# Altium schematic sheet Completo.SchDoc: RADAR
size A4; Author: Almela; Revision: 1.2; SheetNumber: 1; SheetTotal: 7
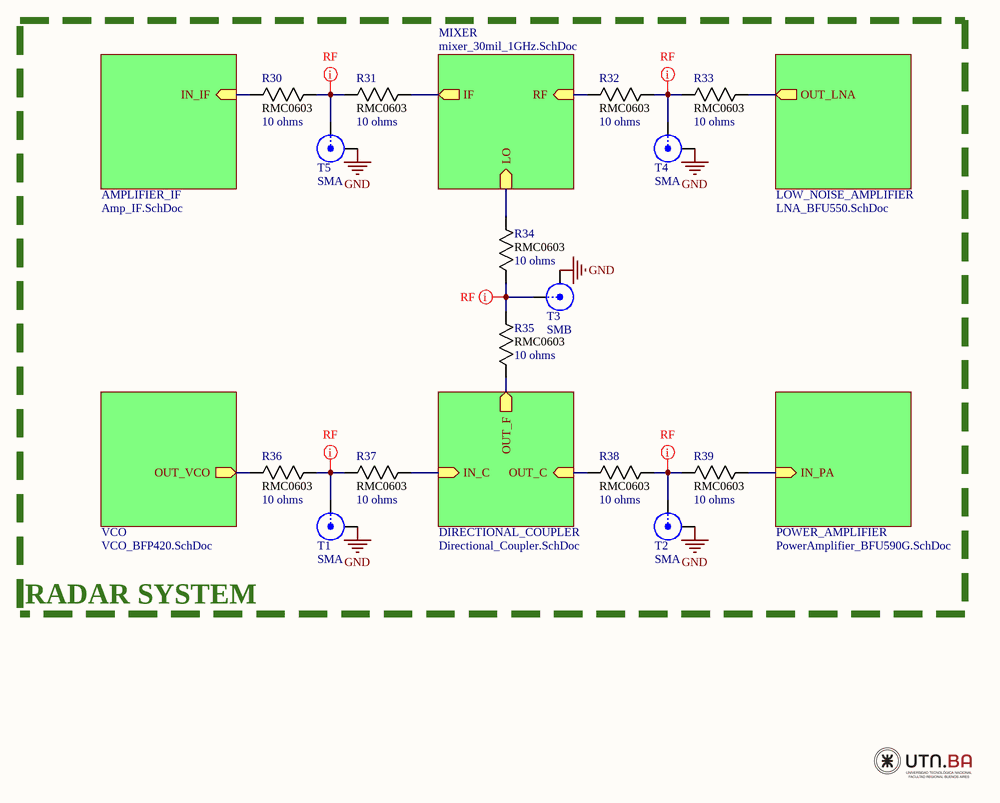
[diagram p0: Completo.SchDoc]

## Parts
R30  value 10 ohms  footprint: RMC0603  [RESC1508X55N]  (hidden comment: Resistor)
R31  value 10 ohms  footprint: RMC0603  [RESC1508X55N]  (hidden comment: Resistor)
R32  value 10 ohms  footprint: RMC0603  [RESC1508X55N]  (hidden comment: Resistor)
R33  value 10 ohms  footprint: RMC0603  [RESC1508X55N]  (hidden comment: Resistor)
R34  value 10 ohms  footprint: RMC0603  [RESC1508X55N]  (hidden comment: Resistor)
R35  value 10 ohms  footprint: RMC0603  [RESC1508X55N]  (hidden comment: Resistor)
R36  value 10 ohms  footprint: RMC0603  [RESC1508X55N]  (hidden comment: Resistor)
R37  value 10 ohms  footprint: RMC0603  [RESC1508X55N]  (hidden comment: Resistor)
R38  value 10 ohms  footprint: RMC0603  [RESC1508X55N]  (hidden comment: Resistor)
R39  value 10 ohms  footprint: RMC0603  [RESC1508X55N]  (hidden comment: Resistor)
T1  SMA  [SMA-142-0701-851]
T2  SMA  [SMA-142-0701-851]
T3  SMB  [SMB_V-RJ45]
T4  SMA  [SMA-142-0701-851]
T5  SMA  [SMA-142-0701-851]

## Sub-sheets
AMPLIFIER_IF = Amp_IF.SchDoc: IN_IF (in)
DIRECTIONAL_COUPLER = Directional_Coupler.SchDoc: IN_C (in), OUT_F (out), OUT_C (in)
LOW_NOISE_AMPLIFIER = LNA_BFU550.SchDoc: OUT_LNA (out)
MIXER = mixer_30mil_1GHz.SchDoc: IF (out), RF (in), LO (in)
POWER_AMPLIFIER = PowerAmplifier_BFU590G.SchDoc: IN_PA (in)
VCO = VCO_BFP420.SchDoc: OUT_VCO (out)

## Nets
GND: T1.2(Y) T2.2(Y) T3.2(Y) T4.2(Y) T5.2(Y)
NetR30_1: R30.1 ; sheet AMPLIFIER_IF/IN_IF
NetR30_2: R30.2 R31.1 T5.1(X)
NetR31_2: R31.2 ; sheet MIXER/IF
NetR32_1: R32.1 ; sheet MIXER/RF
NetR32_2: R32.2 R33.1 T4.1(X)
NetR33_2: R33.2 ; sheet LOW_NOISE_AMPLIFIER/OUT_LNA
NetR34_1: R34.1 R35.2 T3.1(X)
NetR34_2: R34.2 ; sheet MIXER/LO
NetR35_1: R35.1 ; sheet DIRECTIONAL_COUPLER/OUT_F
NetR36_1: R36.1 ; sheet VCO/OUT_VCO
NetR36_2: R36.2 R37.1 T1.1(X)
NetR37_2: R37.2 ; sheet DIRECTIONAL_COUPLER/IN_C
NetR38_1: R38.1 ; sheet DIRECTIONAL_COUPLER/OUT_C
NetR38_2: R38.2 R39.1 T2.1(X)
NetR39_2: R39.2 ; sheet POWER_AMPLIFIER/IN_PA

## Layout directives
net class RF50R: NetR30_2, NetR32_2, NetR34_1, NetR36_2, NetR38_2

## Notes on the sheet
- RADAR SYSTEM

## Library data of the parts
R30-R39 = Resistor: Resistor RMC0603; Mfr_Name: Stackpole International
T1-T5 = SMB: SMB Straight Connector; LatestRevisionDate: 17-Jul-2002; LatestRevisionNote: Re-released for DXP Platform.; Publisher: Altium Limited